# Altium schematic sheet Sheet1.SchDoc
size A1
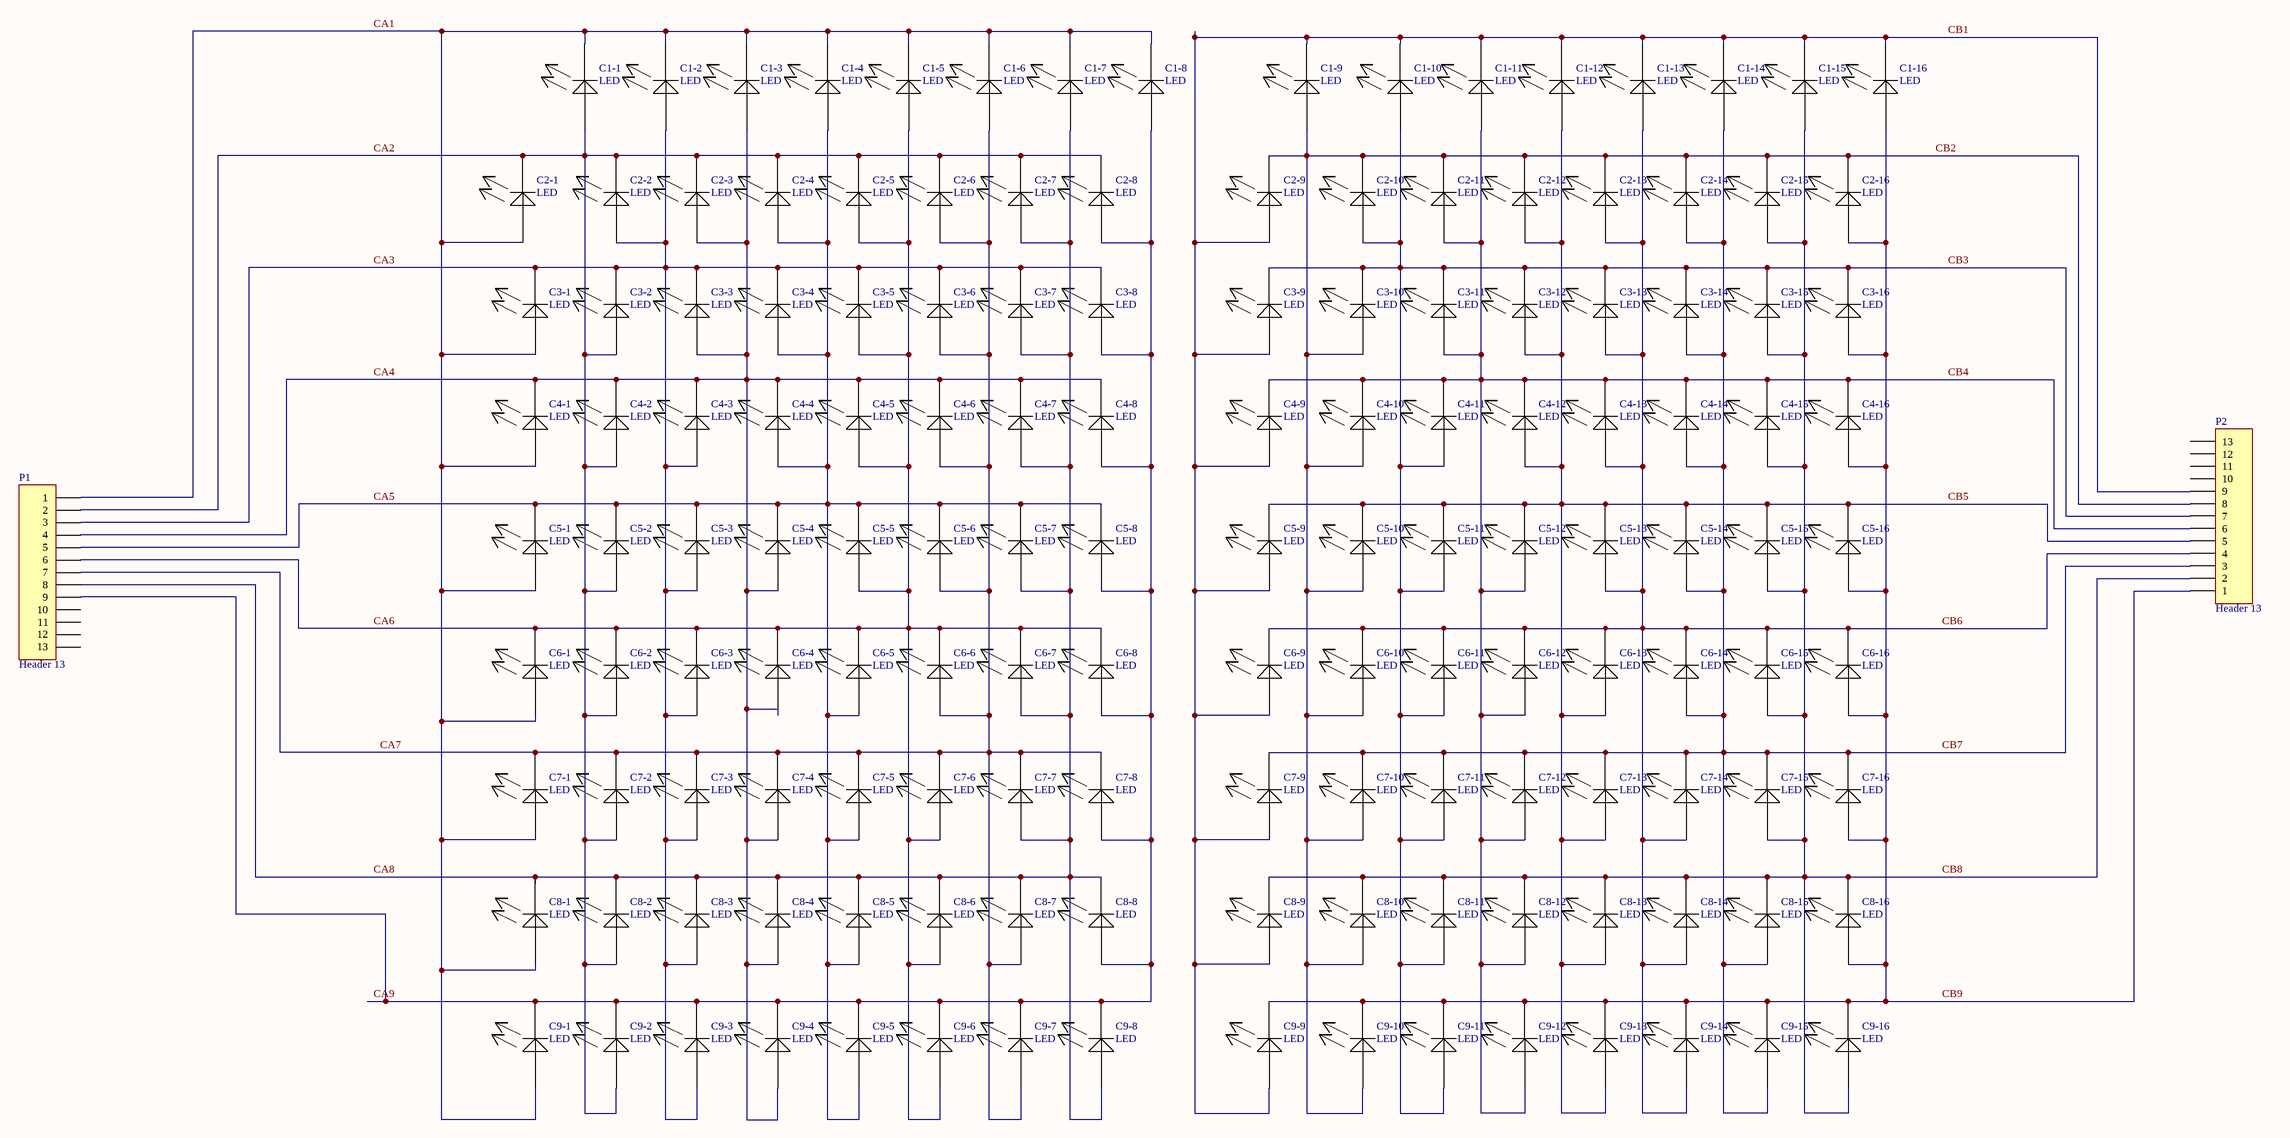
[diagram p0: Sheet1.SchDoc]

## Parts
C1-1  LED  [LED 0603(2)]
C1-2  LED  [LED 0603(2)]
C1-3  LED  [LED 0603(2)]
C1-4  LED  [LED 0603(2)]
C1-5  LED  [LED 0603(2)]
C1-6  LED  [LED 0603(2)]
C1-7  LED  [LED 0603(2)]
C1-8  LED  [LED 0603(2)]
C1-9  LED  [LED 0603(2)]
C1-10  LED  [LED 0603(2)]
C1-11  LED  [LED 0603(2)]
C1-12  LED  [LED 0603(2)]
C1-13  LED  [LED 0603(2)]
C1-14  LED  [LED 0603(2)]
C1-15  LED  [LED 0603(2)]
C1-16  LED  [LED 0603(2)]
C2-1  LED  [LED 0603(2)]
C2-2  LED  [LED 0603(2)]
C2-3  LED  [LED 0603(2)]
C2-4  LED  [LED 0603(2)]
C2-5  LED  [LED 0603(2)]
C2-6  LED  [LED 0603(2)]
C2-7  LED  [LED 0603(2)]
C2-8  LED  [LED 0603(2)]
C2-9  LED  [LED 0603(2)]
C2-10  LED  [LED 0603(2)]
C2-11  LED  [LED 0603(2)]
C2-12  LED  [LED 0603(2)]
C2-13  LED  [LED 0603(2)]
C2-14  LED  [LED 0603(2)]
C2-15  LED  [LED 0603(2)]
C2-16  LED  [LED 0603(2)]
C3-1  LED  [LED 0603(2)]
C3-2  LED  [LED 0603(2)]
C3-3  LED  [LED 0603(2)]
C3-4  LED  [LED 0603(2)]
C3-5  LED  [LED 0603(2)]
C3-6  LED  [LED 0603(2)]
C3-7  LED  [LED 0603(2)]
C3-8  LED  [LED 0603(2)]
C3-9  LED  [LED 0603(2)]
C3-10  LED  [LED 0603(2)]
C3-11  LED  [LED 0603(2)]
C3-12  LED  [LED 0603(2)]
C3-13  LED  [LED 0603(2)]
C3-14  LED  [LED 0603(2)]
C3-15  LED  [LED 0603(2)]
C3-16  LED  [LED 0603(2)]
C4-1  LED  [LED 0603(2)]
C4-2  LED  [LED 0603(2)]
C4-3  LED  [LED 0603(2)]
C4-4  LED  [LED 0603(2)]
C4-5  LED  [LED 0603(2)]
C4-6  LED  [LED 0603(2)]
C4-7  LED  [LED 0603(2)]
C4-8  LED  [LED 0603(2)]
C4-9  LED  [LED 0603(2)]
C4-10  LED  [LED 0603(2)]
C4-11  LED  [LED 0603(2)]
C4-12  LED  [LED 0603(2)]
C4-13  LED  [LED 0603(2)]
C4-14  LED  [LED 0603(2)]
C4-15  LED  [LED 0603(2)]
C4-16  LED  [LED 0603(2)]
C5-1  LED  [LED 0603(2)]
C5-2  LED  [LED 0603(2)]
C5-3  LED  [LED 0603(2)]
C5-4  LED  [LED 0603(2)]
C5-5  LED  [LED 0603(2)]
C5-6  LED  [LED 0603(2)]
C5-7  LED  [LED 0603(2)]
C5-8  LED  [LED 0603(2)]
C5-9  LED  [LED 0603(2)]
C5-10  LED  [LED 0603(2)]
C5-11  LED  [LED 0603(2)]
C5-12  LED  [LED 0603(2)]
C5-13  LED  [LED 0603(2)]
C5-14  LED  [LED 0603(2)]
C5-15  LED  [LED 0603(2)]
C5-16  LED  [LED 0603(2)]
C6-1  LED  [LED 0603(2)]
C6-2  LED  [LED 0603(2)]
C6-3  LED  [LED 0603(2)]
C6-4  LED  [LED 0603(2)]
C6-5  LED  [LED 0603(2)]
C6-6  LED  [LED 0603(2)]
C6-7  LED  [LED 0603(2)]
C6-8  LED  [LED 0603(2)]
C6-9  LED  [LED 0603(2)]
C6-10  LED  [LED 0603(2)]
C6-11  LED  [LED 0603(2)]
C6-12  LED  [LED 0603(2)]
C6-13  LED  [LED 0603(2)]
C6-14  LED  [LED 0603(2)]
C6-15  LED  [LED 0603(2)]
C6-16  LED  [LED 0603(2)]
C7-1  LED  [LED 0603(2)]
C7-2  LED  [LED 0603(2)]
C7-3  LED  [LED 0603(2)]
C7-4  LED  [LED 0603(2)]
C7-5  LED  [LED 0603(2)]
C7-6  LED  [LED 0603(2)]
C7-7  LED  [LED 0603(2)]
C7-8  LED  [LED 0603(2)]
C7-9  LED  [LED 0603(2)]
C7-10  LED  [LED 0603(2)]
C7-11  LED  [LED 0603(2)]
C7-12  LED  [LED 0603(2)]
C7-13  LED  [LED 0603(2)]
C7-14  LED  [LED 0603(2)]
C7-15  LED  [LED 0603(2)]
C7-16  LED  [LED 0603(2)]
C8-1  LED  [LED 0603(2)]
C8-2  LED  [LED 0603(2)]
C8-3  LED  [LED 0603(2)]
C8-4  LED  [LED 0603(2)]
C8-5  LED  [LED 0603(2)]
C8-6  LED  [LED 0603(2)]
C8-7  LED  [LED 0603(2)]
C8-8  LED  [LED 0603(2)]
C8-9  LED  [LED 0603(2)]
C8-10  LED  [LED 0603(2)]
C8-11  LED  [LED 0603(2)]
C8-12  LED  [LED 0603(2)]
C8-13  LED  [LED 0603(2)]
C8-14  LED  [LED 0603(2)]
C8-15  LED  [LED 0603(2)]
C8-16  LED  [LED 0603(2)]
C9-1  LED  [LED 0603(2)]
C9-2  LED  [LED 0603(2)]
C9-3  LED  [LED 0603(2)]
C9-4  LED  [LED 0603(2)]
C9-5  LED  [LED 0603(2)]
C9-6  LED  [LED 0603(2)]
C9-7  LED  [LED 0603(2)]
C9-8  LED  [LED 0603(2)]
C9-9  LED  [LED 0603(2)]
C9-10  LED  [LED 0603(2)]
C9-11  LED  [LED 0603(2)]
C9-12  LED  [LED 0603(2)]
C9-13  LED  [LED 0603(2)]
C9-14  LED  [LED 0603(2)]
C9-15  LED  [LED 0603(2)]
C9-16  LED  [LED 0603(2)]
P1  Header 13  [HDR1X13]
P2  Header 13  [HDR1X13]

## Nets
CA1: C1-1.2(-) C1-2.2(-) C1-3.2(-) C1-4.2(-) C1-5.2(-) C1-6.2(-) C1-7.2(-) C1-8.2(-) C2-1.1(+) C3-1.1(+) C4-1.1(+) C5-1.1(+) C6-1.1(+) C7-1.1(+) C8-1.1(+) C9-1.1(+) P1.1
CA2: C1-1.1(+) C2-1.2(-) C2-2.2(-) C2-3.2(-) C2-4.2(-) C2-5.2(-) C2-6.2(-) C2-7.2(-) C2-8.2(-) C3-2.1(+) C4-2.1(+) C5-2.1(+) C6-2.1(+) C7-2.1(+) C8-2.1(+) C9-2.1(+) P1.2
CA3: C1-2.1(+) C2-2.1(+) C3-1.2(-) C3-2.2(-) C3-3.2(-) C3-4.2(-) C3-5.2(-) C3-6.2(-) C3-7.2(-) C3-8.2(-) C4-3.1(+) C5-3.1(+) C6-3.1(+) C7-3.1(+) C8-3.1(+) C9-3.1(+) P1.3
CA4: C1-3.1(+) C2-3.1(+) C3-3.1(+) C4-1.2(-) C4-2.2(-) C4-3.2(-) C4-4.2(-) C4-5.2(-) C4-6.2(-) C4-7.2(-) C4-8.2(-) C5-4.1(+) C6-4.1(+) C7-4.1(+) C8-4.1(+) C9-4.1(+) P1.4
CA5: C1-4.1(+) C2-4.1(+) C3-4.1(+) C4-4.1(+) C5-1.2(-) C5-2.2(-) C5-3.2(-) C5-4.2(-) C5-5.2(-) C5-6.2(-) C5-7.2(-) C5-8.2(-) C6-5.1(+) C7-5.1(+) C8-5.1(+) C9-5.1(+) P1.5
CA6: C1-5.1(+) C2-5.1(+) C3-5.1(+) C4-5.1(+) C5-5.1(+) C6-1.2(-) C6-2.2(-) C6-3.2(-) C6-4.2(-) C6-5.2(-) C6-6.2(-) C6-7.2(-) C6-8.2(-) C7-6.1(+) C8-6.1(+) C9-6.1(+) P1.6
CA7: C1-6.1(+) C2-6.1(+) C3-6.1(+) C4-6.1(+) C5-6.1(+) C6-6.1(+) C7-1.2(-) C7-2.2(-) C7-3.2(-) C7-4.2(-) C7-5.2(-) C7-6.2(-) C7-7.2(-) C7-8.2(-) C8-7.1(+) C9-7.1(+) P1.7
CA8: C1-7.1(+) C2-7.1(+) C3-7.1(+) C4-7.1(+) C5-7.1(+) C6-7.1(+) C7-7.1(+) C8-1.2(-) C8-2.2(-) C8-3.2(-) C8-4.2(-) C8-5.2(-) C8-6.2(-) C8-7.2(-) C8-8.2(-) C9-8.1(+) P1.8
CA9: C1-8.1(+) C2-8.1(+) C3-8.1(+) C4-8.1(+) C5-8.1(+) C6-8.1(+) C7-8.1(+) C8-8.1(+) C9-1.2(-) C9-2.2(-) C9-3.2(-) C9-4.2(-) C9-5.2(-) C9-6.2(-) C9-7.2(-) C9-8.2(-) P1.9
CB1: C1-9.2(-) C1-10.2(-) C1-11.2(-) C1-12.2(-) C1-13.2(-) C1-14.2(-) C1-15.2(-) C1-16.2(-) C2-9.1(+) C3-9.1(+) C4-9.1(+) C5-9.1(+) C6-9.1(+) C7-9.1(+) C8-9.1(+) C9-9.1(+) P2.9
CB2: C1-9.1(+) C2-9.2(-) C2-10.2(-) C2-11.2(-) C2-12.2(-) C2-13.2(-) C2-14.2(-) C2-15.2(-) C2-16.2(-) C3-10.1(+) C4-10.1(+) C5-10.1(+) C6-10.1(+) C7-10.1(+) C8-10.1(+) C9-10.1(+) P2.8
CB3: C1-10.1(+) C2-10.1(+) C3-9.2(-) C3-10.2(-) C3-11.2(-) C3-12.2(-) C3-13.2(-) C3-14.2(-) C3-15.2(-) C3-16.2(-) C4-11.1(+) C5-11.1(+) C6-11.1(+) C7-11.1(+) C8-11.1(+) C9-11.1(+) P2.7
CB4: C1-11.1(+) C2-11.1(+) C3-11.1(+) C4-9.2(-) C4-10.2(-) C4-11.2(-) C4-12.2(-) C4-13.2(-) C4-14.2(-) C4-15.2(-) C4-16.2(-) C5-12.1(+) C6-12.1(+) C7-12.1(+) C8-12.1(+) C9-12.1(+) P2.6
CB5: C1-12.1(+) C2-12.1(+) C3-12.1(+) C4-12.1(+) C5-9.2(-) C5-10.2(-) C5-11.2(-) C5-12.2(-) C5-13.2(-) C5-14.2(-) C5-15.2(-) C5-16.2(-) C6-13.1(+) C7-13.1(+) C8-13.1(+) C9-13.1(+) P2.5
CB6: C1-13.1(+) C2-13.1(+) C3-13.1(+) C4-13.1(+) C5-13.1(+) C6-9.2(-) C6-10.2(-) C6-11.2(-) C6-12.2(-) C6-13.2(-) C6-14.2(-) C6-15.2(-) C6-16.2(-) C7-14.1(+) C8-14.1(+) C9-14.1(+) P2.4
CB7: C1-14.1(+) C2-14.1(+) C3-14.1(+) C4-14.1(+) C5-14.1(+) C6-14.1(+) C7-9.2(-) C7-10.2(-) C7-11.2(-) C7-12.2(-) C7-13.2(-) C7-14.2(-) C7-15.2(-) C7-16.2(-) C8-15.1(+) C9-15.1(+) P2.3
CB8: C1-15.1(+) C2-15.1(+) C3-15.1(+) C4-15.1(+) C5-15.1(+) C6-15.1(+) C7-15.1(+) C8-9.2(-) C8-10.2(-) C8-11.2(-) C8-12.2(-) C8-13.2(-) C8-14.2(-) C8-15.2(-) C8-16.2(-) C9-16.1(+) P2.2
CB9: C1-16.1(+) C2-16.1(+) C3-16.1(+) C4-16.1(+) C5-16.1(+) C6-16.1(+) C7-16.1(+) C8-16.1(+) C9-9.2(-) C9-10.2(-) C9-11.2(-) C9-12.2(-) C9-13.2(-) C9-14.2(-) C9-15.2(-) C9-16.2(-) P2.1

Not connected (* = marked no-connect by the designer): P1 10 11 12 13; P2 10 11 12 13

## Library data of the parts
P1 P2 = Header 13: Header, 13-Pin; LatestRevisionDate: 17-Jul-2002; LatestRevisionNote: Re-released for DXP Platform.; Publisher: Altium Limited